# EAGLE design Schematic (EAGLE 7.2.0)
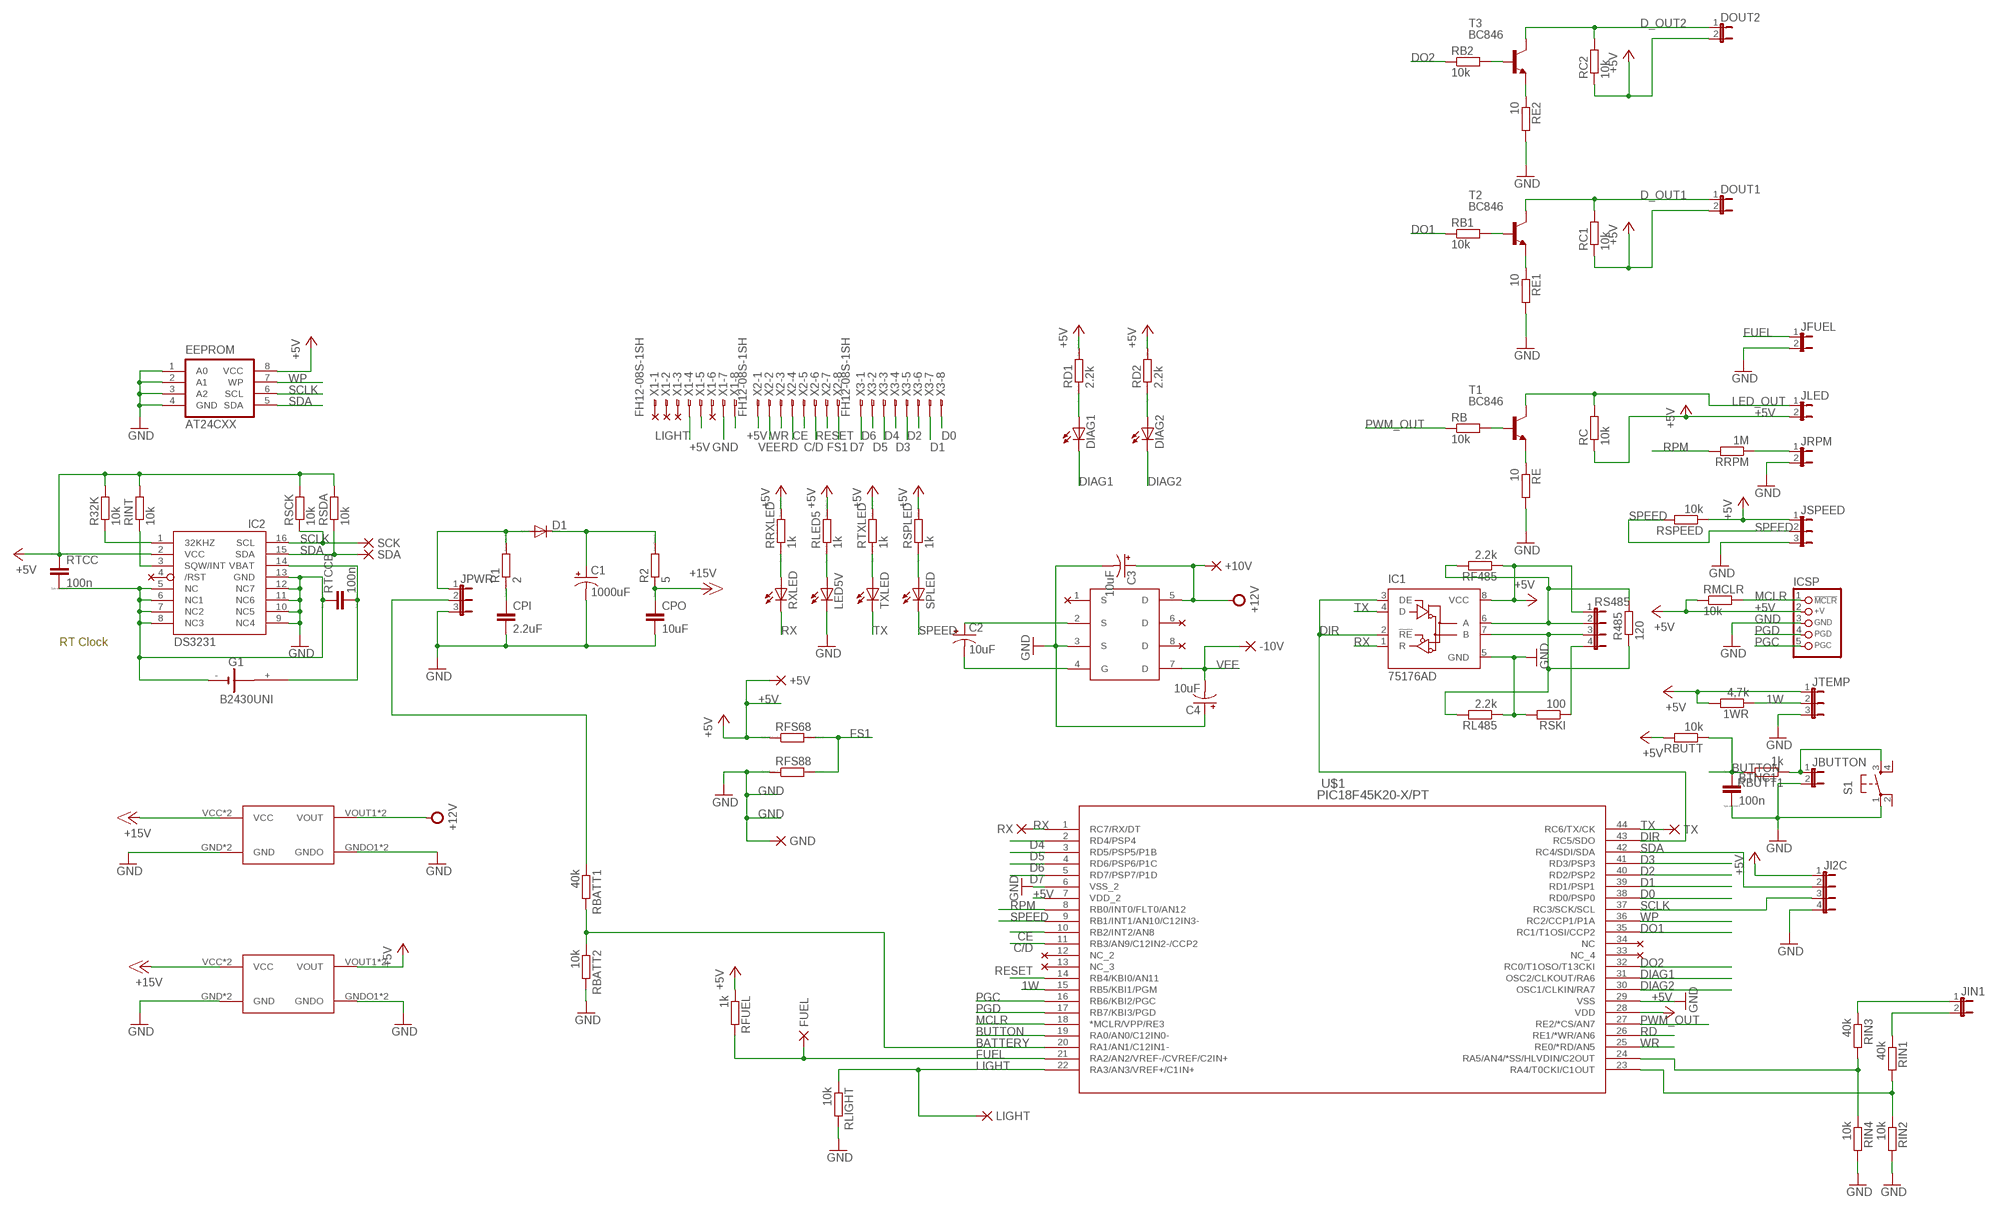
[diagram p0: schematic, sheet 1]

## Parts
1WR  4,7k  R-EU_R0603  [R0603]
+5V  PAD-SMD20R  [SMD20R]
+10V  PAD-SMD20R  [SMD20R]
-10V  PAD-SMD20R  [SMD20R]
BTNC1  100n  CC1206  [C1206]
C1  1000uF  CAP_POLPTH4  [CPOL-RADIAL-1000UF-25V]
C2  10uF  10UF-16V-10%(TANT)  [EIA3216]
C3  10uF  10UF-16V-10%(TANT)  [EIA3216]
C4  10uF  10UF-16V-10%(TANT)  [EIA3216]
CPI  2.2uF  C-EUC1206  [C1206]
CPO  10uF  C-EUC1206  [C1206]
D1  DIODE-SOD106-R  [SOD106-R]
DIAG1  LEDCHIPLED_0603  [CHIPLED_0603]
DIAG2  LEDCHIPLED_0603  [CHIPLED_0603]
DOUT1  JP1E  [JP1]
DOUT2  JP1E  [JP1]
EEPROM  AT24CXX  [SO08-8S1]
FUEL  PAD-SMD20R  [SMD20R]
G1  B2430UNI  [B2430UNI]
GND  PAD-SMD20R  [SMD20R]
IC1  75176AD  [D_R-PDSO-G8]
IC2  DS3231/SO  [SO16W]
ICSP  CON_HEADER_PRG_PIC_ICSPB  [HEADER_PRG_1X05_ICSP_B]
JBUTTON  JP1E  [JP1]
JFUEL  JP1E  [JP1]
JI2C  JP4E  [JP4]
JIN1  JP1E  [JP1]
JLED  JP1E  [JP1]
JPWR  JP2E  [JP2]
JRPM  JP1E  [JP1]
JSPEED  JP2E  [JP2]
JTEMP  JP2E  [JP2]
LED5V  LEDCHIPLED_0603  [CHIPLED_0603]
LIGHT  PAD-SMD20R  [SMD20R]
PW5  DCDC_EBAY  [DCDC_EBAY]
PW12  DCDC_EBAY  [DCDC_EBAY]
R1  2  RR1206  [R1206]
R2  5  RR1206  [R1206]
R32K  10k  R-EU_R0603  [R0603]
R485  120  R-EU_R0603  [R0603]
RB  10k  R-EU_R0603  [R0603]
RB1  10k  R-EU_R0603  [R0603]
RB2  10k  R-EU_R0603  [R0603]
RBATT1  40k  R-EU_R0603  [R0603]
RBATT2  10k  R-EU_R0603  [R0603]
RBUTT  10k  R-EU_R0603  [R0603]
RBUTT1  1k  R-EU_R0603  [R0603]
RC  10k  R-EU_R0603  [R0603]
RC1  10k  R-EU_R0603  [R0603]
RC2  10k  R-EU_R0603  [R0603]
RD1  2.2k  RR0603  [R0603]
RD2  2.2k  RR0603  [R0603]
RE  10  R-EU_R0603  [R0603]
RE1  10  R-EU_R0603  [R0603]
RE2  10  R-EU_R0603  [R0603]
RF485  2.2k  R-EU_R0603  [R0603]
RFS68  RR0603  [R0603]
RFS88  RR0603  [R0603]
RFUEL  1k  R-EU_R0603  [R0603]
RIN1  40k  R-EU_R0603  [R0603]
RIN2  10k  R-EU_R0603  [R0603]
RIN3  40k  R-EU_R0603  [R0603]
RIN4  10k  R-EU_R0603  [R0603]
RINT  10k  R-EU_R0603  [R0603]
RL485  2.2k  R-EU_R0603  [R0603]
RLED5  1k  RR0603  [R0603]
RLIGHT  10k  R-EU_R0603  [R0603]
RMCLR  10k  R-EU_R0603  [R0603]
RRPM  1M  R-EU_R0603  [R0603]
RRXLED  1k  RR0603  [R0603]
RS485  JP4E  [JP4]
RSCK  10k  R-EU_R0603  [R0603]
RSDA  10k  R-EU_R0603  [R0603]
RSKI  100  R-EU_R0603  [R0603]
RSPEED  10k  R-EU_R0603  [R0603]
RSPLED  1k  RR0603  [R0603]
RTCC  100n  CC1206  [C1206]
RTCCB  100n  CC1206  [C1206]
RTXLED  1k  RR0603  [R0603]
RX  PAD-SMD20R  [SMD20R]
RXLED  LEDCHIPLED_0603  [CHIPLED_0603]
S1  TAC_SWITCHPTH  [TACTILE-PTH]
SCK  PAD-SMD20R  [SMD20R]
SDA  PAD-SMD20R  [SMD20R]
SPLED  LEDCHIPLED_0603  [CHIPLED_0603]
T1  BC846  [SOT23]
T2  BC846  [SOT23]
T3  BC846  [SOT23]
TX  PAD-SMD20R  [SMD20R]
TXLED  LEDCHIPLED_0603  [CHIPLED_0603]
U$1  PIC18F45K20-X/PT  [TQFP44_MC]
U$2  NDS8434  [SO08]
U$3  NC  [NC]
U$4  NC  [NC]
U$5  NC  [NC]
U$6  NC  [NC]
U$7  NC  [NC]
U$8  NC  [NC]
U$9  NC  [NC]
U$10  NC  [NC]
U$11  NC  [NC]
U$12  NC  [NC]
U$13  NC  [NC]
U$14  NC  [NC]
U$15  NC  [NC]
U$16  NC  [NC]
U$17  NC  [NC]
X1  FH12-08S-1SH  [FH12-08S-1SH]
X2  FH12-08S-1SH  [FH12-08S-1SH]
X3  FH12-08S-1SH  [FH12-08S-1SH]

## Nets
1W: 1WR.1 JTEMP.2 U$1.15(RB5/KBI1/PGM)
+5V: 1WR.2 +5V.PAD(P) DOUT1.2 DOUT2.2 EEPROM.8(VCC) IC1.8(VCC) IC2.2(VCC) ICSP.2(+V) JI2C.1 JLED.2 JSPEED.1 JTEMP.1 PW5.VOUT1(VOUT) PW5.VOUT2(VOUT) R32K.2 RBUTT.2 RC1.1 RC2.1 RC.1 RD1.2 RD2.2 RF485.1 RFS68.1 RFUEL.1 RINT.2 RLED5.2 RMCLR.1 RRXLED.2 RS485.1 RSCK.2 RSDA.2 RSPEED.1 RSPLED.2 RTCC.1 RTXLED.2 U$1.7(VDD_2) U$1.28(VDD) X1.5 X2.1
+12V: +10V.PAD(P) C3.A(+) PW12.VOUT1(VOUT) PW12.VOUT2(VOUT) U$2.5(D)
+15V: CPO.1 PW5.VCC PW5.VCCIN(VCC) PW12.VCC PW12.VCCIN(VCC) R2.1
BATTERY: RBATT1.2 RBATT2.1 U$1.20(RA1/AN1/C12IN1-)
BATTERY1: RIN1.2 RIN2.1 U$1.23(RA4/T0CKI/C1OUT)
BATTERY2: RIN3.2 RIN4.1 U$1.24(RA5/AN4/*SS/HLVDIN/C2OUT)
BUTTON: BTNC1.1 RBUTT1.2 RBUTT.1 U$1.19(RA0/AN0/C12IN0-)
C/D: U$1.11(RB3/AN9/C12IN2-/CCP2) X2.6
CE: U$1.10(RB2/INT2/AN8) X2.5
D0: U$1.38(RD0/PSP0) X3.8
D1: U$1.39(RD1/PSP1) X3.7
D2: U$1.40(RD2/PSP2) X3.6
D3: U$1.41(RD3/PSP3) X3.5
D4: U$1.2(RD4/PSP4) X3.4
D5: U$1.3(RD5/PSP5/P1B) X3.3
D6: U$1.4(RD6/PSP6/P1C) X3.2
D7: U$1.5(RD7/PSP7/P1D) X3.1
D_OUT1: DOUT1.1 RC1.2 T2.3(C)
D_OUT2: DOUT2.1 RC2.2 T3.3(C)
DIAG1: DIAG1.C U$1.31(OSC2/CLKOUT/RA6)
DIAG2: DIAG2.C U$1.30(OSC1/CLKIN/RA7)
DIR: IC1.2(!RE) IC1.3(DE) U$1.43(RC5/SDO)
DO1: RB1.1 U$1.35(RC1/T1OSI/CCP2)
DO2: RB2.1 U$1.32(RC0/T1OSO/T13CKI)
FS1: RFS68.2 RFS88.2 X2.8
FUEL: FUEL.PAD(P) JFUEL.1 RFUEL.2 U$1.21(RA2/AN2/VREF-/CVREF/C2IN+)
GND: BTNC1.2 C1.2(-) C3.C(-) C4.A(+) CPI.2 CPO.2 EEPROM.1(A0) EEPROM.2(A1) EEPROM.3(A2) EEPROM.4(GND) G1.- GND.PAD(P) IC1.5(GND) IC2.5(NC) IC2.6(NC1) IC2.7(NC2) IC2.8(NC3) IC2.9(NC4) IC2.10(NC5) IC2.11(NC6) IC2.12(NC7) IC2.13(GND) ICSP.3(GND) JBUTTON.2 JFUEL.2 JI2C.4 JPWR.3 JRPM.2 JSPEED.3 JTEMP.3 LED5V.C PW5.GND PW5.GND2(GND) PW5.GNDO1(GNDO) PW5.GNDO2(GNDO) PW12.GND PW12.GND2(GND) PW12.GNDO1(GNDO) PW12.GNDO2(GNDO) RBATT2.2 RE1.2 RE2.2 RE.2 RFS88.1 RIN2.2 RIN4.2 RL485.1 RLIGHT.2 RSKI.2 RTCC.2 RTCCB.1 S1.1 U$1.6(VSS_2) U$1.29(VSS) U$2.3(S) X1.7 X1.8
LED_OUT: JLED.1 RC.2 T1.3(C)
LIGHT: LIGHT.PAD(P) RLIGHT.1 U$1.22(RA3/AN3/VREF+/C1IN+) X1.4
MCLR: ICSP.1(/MCLR) RMCLR.2 U$1.18(*MCLR/VPP/RE3)
N$1: LED5V.A RLED5.1
N$2: RRXLED.1 RXLED.A
N$3: RTXLED.1 TXLED.A
N$4: JBUTTON.1 RBUTT1.1 S1.3
N$5: RE.1 T1.2(E)
N$6: JRPM.1 RRPM.1
N$7: RB.2 T1.1(B)
N$8: JPWR.2 RBATT1.1
N$9: RE1.1 T2.2(E)
N$10: RB1.2 T2.1(B)
N$11: RE2.1 T3.2(E)
N$12: RB2.2 T3.1(B)
N$13: DIAG1.A RD1.1
N$14: C1.1(+) D1.C R2.2
N$15: CPI.1 R1.1
N$16: RSPLED.1 SPLED.A
N$17: C2.A(+) U$2.2(S)
N$18: C2.C(-) U$2.4(G)
N$19: IC1.6(A) R485.2 RF485.2 RS485.2
N$20: IC1.7(B) R485.1 RL485.2 RS485.3
N$21: JIN1.2 RIN1.1
N$22: IC2.1(32KHZ) R32K.1
N$23: IC2.3(SQW/INT) RINT.1
N$24: G1.+ IC2.14(VBAT) RTCCB.2
N$25: JIN1.1 RIN3.1
N$26: D1.A JPWR.1 R1.2
N$27: DIAG2.A RD2.1
N$29: RS485.4 RSKI.1
PGC: ICSP.5(PGC) U$1.16(RB6/KBI2/PGC)
PGD: ICSP.4(PGD) U$1.17(RB7/KBI3/PGD)
PWM_OUT: RB.1 U$1.27(RE2/*CS/AN7)
RD: U$1.26(RE1/*WR/AN6) X2.4
RESET: U$1.14(RB4/KBI0/AN11) X2.7
RPM: RRPM.2 U$1.8(RB0/INT0/FLT0/AN12)
RX: IC1.1(R) RX.PAD(P) RXLED.C U$1.1(RC7/RX/DT)
SCLK: EEPROM.6(SCL) IC2.16(SCL) JI2C.3 RSCK.1 SCK.PAD(P) U$1.37(RC3/SCK/SCL)
SDA: EEPROM.5(SDA) IC2.15(SDA) JI2C.2 RSDA.1 SDA.PAD(P) U$1.42(RC4/SDI/SDA)
SPEED: JSPEED.2 RSPEED.2 SPLED.C U$1.9(RB1/INT1/AN10/C12IN3-)
TX: IC1.4(D) TX.PAD(P) TXLED.C U$1.44(RC6/TX/CK)
VEE: -10V.PAD(P) C4.C(-) U$2.7(D) X2.2
WP: EEPROM.7(WP) U$1.36(RC2/CCP1/P1A)
WR: U$1.25(RE0/*RD/AN5) X2.3
Unconnected: G1.+@1(+) G1.+@2(+) G1.+@3(+) G1.+@4(+) G1.-@1(-) IC2.4(/RST) S1.2 S1.4 U$1.12(NC_2) U$1.13(NC_3) U$1.33(NC_4) U$1.34(NC) U$2.1(S) U$2.6(D) U$2.8(D) X1.1 X1.2 X1.3 X1.6

## Notes on the sheet
- RT Clock

## Library data of the parts
1WR R485 RB RB1 RB2 RBATT1 RBATT2 RBUTT RBUTT1 RC RC1 RC2 RE RE1 RE2 RF485 RFUEL RIN1-RIN4 RL485 RLIGHT RMCLR RRPM RSKI RSPEED = resistor_3rdPin_v20:R-EU_: RESISTOR, European symbol
+5V +10V -10V FUEL GND LIGHT RX SCK SDA TX = dpads:PAD: WIRE PAD Standard US Drill Sizes and SMD pads
BTNC1 RTCC RTCCB = eagle-ltspice:C: CAPACITOR, European symbol; SPICEMODEL: NONE; SPICEPREFIX: C
C1 = SparkFun-Capacitors:CAP_POL: Capacitor Polarized These are standard SMD and PTH capacitors. Normally 10uF, 47uF, and 100uF in electrolytic and tantalum varieties. Always verify the external diameter of the through hole cap, it varies with capacity, voltage, and manufacturer. The EIA devices should be standard.
C2-C4 = SparkFun-Capacitors:10UF-16V-10%(TANT): CAP-00811 1206/EIA-3216 Tantalum capacitor; PROD_ID: CAP-00811
CPI CPO = resistor:C-EU: CAPACITOR, European symbol
D1 = diode:DIODE-: DIODE
DIAG1 DIAG2 LED5V RXLED SPLED TXLED = adafruit:LED: LED OSRAM: - CHIPLED LG R971, LG N971, LY N971, LG Q971, LY Q971, LO R971, LY R971 LH N974, LH R974 LS Q976, LO Q976, LY Q976 LO Q996 - Hyper CHIPLED LW Q18S LB Q993, LB Q99A, LB R99A - SideLED LS A670, LO A670, LY A670, LG A670, LP A670 LB A673, LV A673, LT A673, LW A673 LH A674 LY A675 LS A676, LA A676, LO A676, LY A676, LW A676 LS A679, LY A679, LG A679 - Hyper Micro SIDELED® LS Y876, LA Y876, LO Y876, LY Y876 LT Y87S - SmartLED LW L88C, LW L88S LB L89C, LB L89S, LG L890 LS L89K, LO L89K, LY L89K LS L896, LA L896, LO L896, LY L896 - TOPLED LS T670, LO T670, LY T670, LG T670, LP T670 LSG T670, LSP T670, LSY T670, LOP T670, LYG T670 LG T671, LOG T671, LSG T671 LB T673, LV T673, LT T673, LW T673 LH T674 LS T676, LA T676, LO T676, LY T676, LB T676, LH T676, LSB T676, LW T676 LB T67C, LV T67C, LT T67C, LS T67K, LO T67K, LY T67K, LW E67C LS E67B, LA E67B, LO E67B, LY E67B, LB E67C, LV E67C, LT E67C LW T67C LS T679, LY T679, LG T679 LS T770, LO T770, LY T770, LG T770, LP T770 LB T773, LV T773, LT T773, LW T773 LH T774 LS E675, LA E675, LY E675, LS T675 LS T776, LA T776, LO T776, LY T776, LB T776 LHGB T686 LT T68C, LB T68C - Hyper Mini TOPLED® LB M676 - Mini TOPLED Santana® LG M470 LS M47K, LO M47K, LY M47K Source: http://www.osram.convergy.de/
DOUT1 DOUT2 JBUTTON JFUEL JIN1 JLED JRPM = jumper:JP1E: JUMPER
EEPROM = memory-atmel:AT24CXX: EEPROM SPI bus serial
G1 = battery:B2430UNI: LI BATTERY
IC1 = 751xx:75176A: DIFFERENTIAL BUS TRANSCEIVER Source: http://focus.ti.com/lit/ds/symlink/sn75176a.pdf
IC2 = adafruit:DS3231
ICSP = dp_devices:CON_HEADER_PRG_PIC_ICSP: 5-pin PIC In Circuit Serial Programming header
JI2C RS485 = jumper:JP4E: JUMPER
JPWR JSPEED JTEMP = jumper:JP2E: JUMPER
PW5 PW12 = DCDC_ebay:DCDC_EBAY
R1 R2 RD1 RD2 RFS68 RFS88 RLED5 RRXLED RSPLED RTXLED = eagle-ltspice:R: RESISTOR, European symbol; SPICEMODEL: NONE; SPICEPREFIX: R
R32K RINT RSCK RSDA = resistor:R-EU_: RESISTOR, European symbol
S1 = SparkFun:TAC_SWITCH: Momentary Switch Button commonly used for reset or general input. Spark Fun Electronics SKU : COM-00097
T1-T3 = transistor:BC846: NPN TRANSISTOR
U$1 = PIC18F45K20_SMD:PIC18F45K20-X/PT
U$2 = SparkFun-DiscreteSemi:NDS8434: 8-SOIC NMOSFET
U$3-U$17 = divers:NC: No connect symbol
X1-X3 = con-hirose:FH12-08S-1S: 1mm Pitch Connectors For FPC/FFC Source: Data sheet <http://www.hirose.co.jp/cataloge_hp/e58605370.pdf>; OC_FARNELL: unknown; OC_NEWARK: unknown

## Board
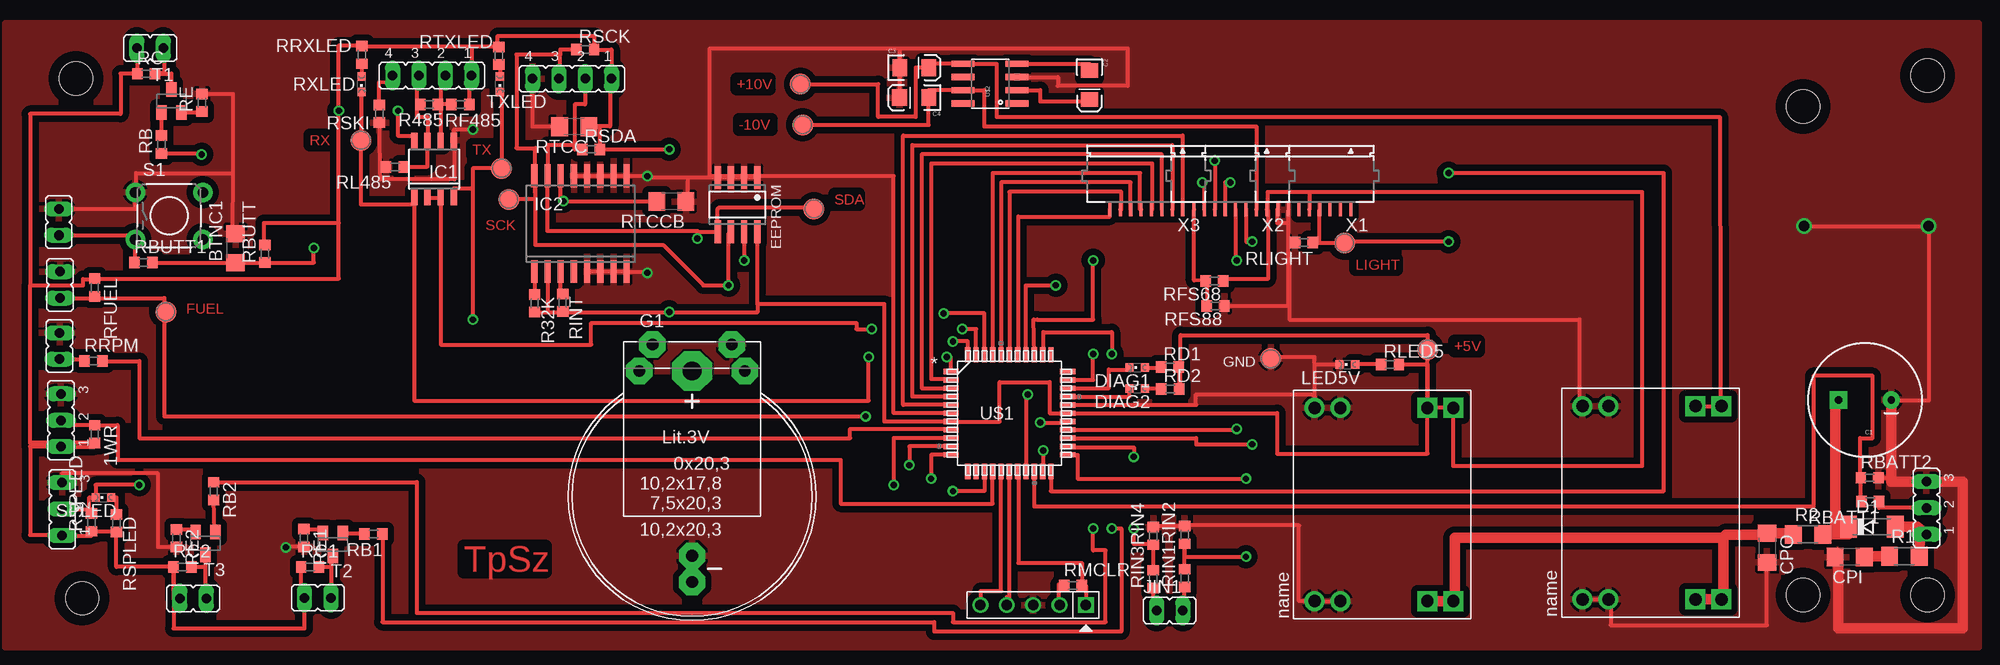
[diagram p1: board, top side]
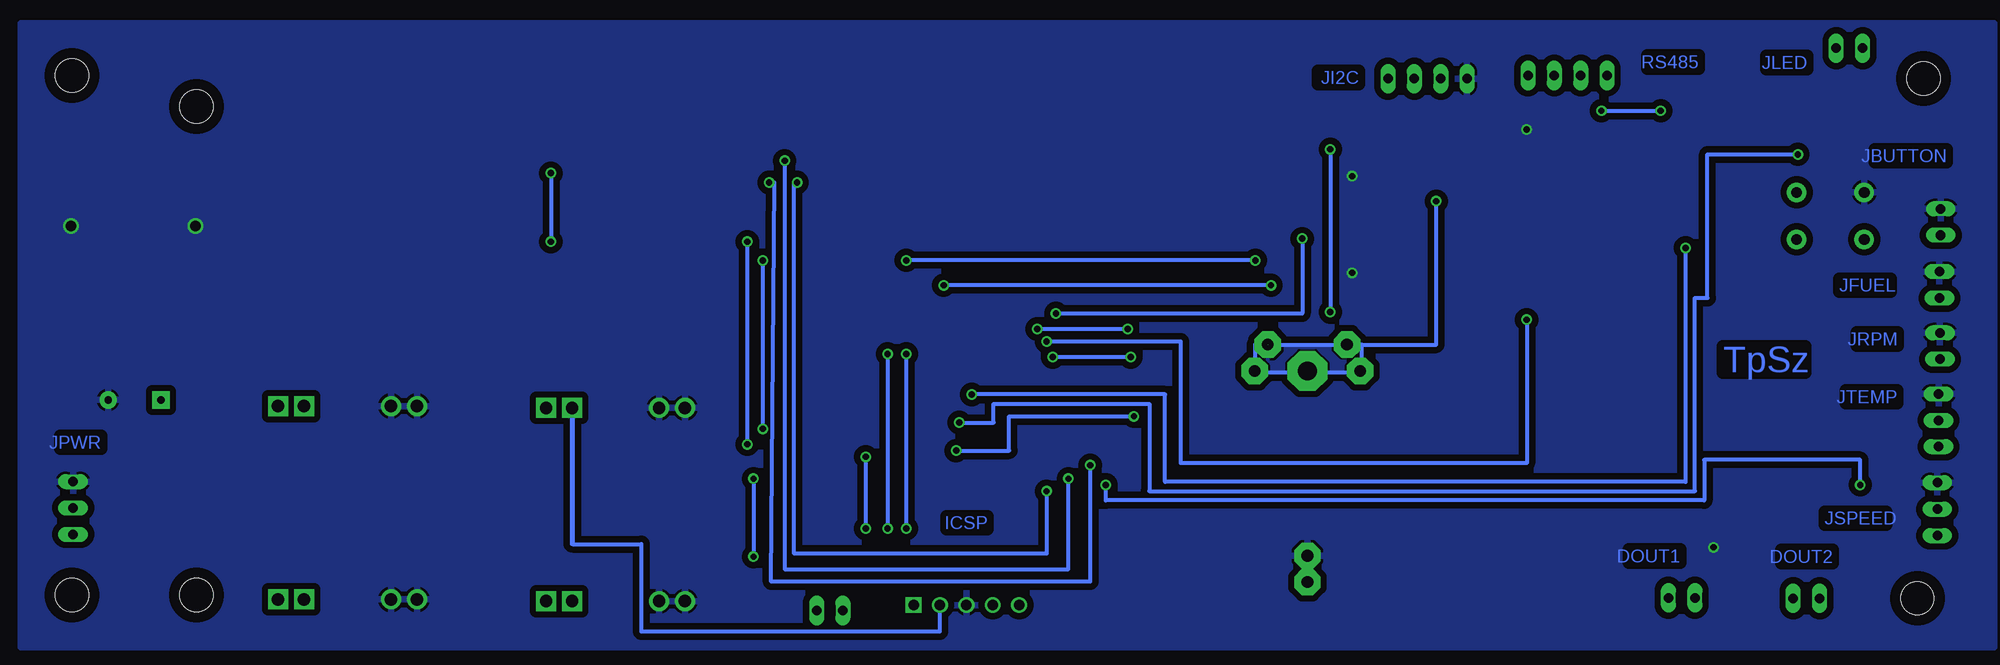
[diagram p2: board, bottom side, seen from below]

No outline drawn. Coordinates in mm, seen from the top.
Copper layers (1*16): Top 0.035mm / dielectric 1.5mm / Bottom 0.035mm
Design rules "default": minimum track width 10mil, minimum drill 24mil, track to track 8mil, track to pad 8mil, pad to pad 8mil, via to via 8mil, smd to smd 8mil, copper to edge 40mil, drill to drill 8mil, minimum pad ring 10mil, minimum via ring 8mil, stop-mask expansion 4mil, vias tented up to drill 0mil, thermal gap 10mil
Holes 3.2 mm at 7.4,4.7 6.8,54.7 185,55 185,5 173,52 173,5

### Footprints (pad centres in the part's own frame; a part is rotated, then mirrored left to right if it is on the bottom)
R0603 = smd 1 x 1.1: 1 -0.85,0; 2 0.85,0
SMD20R = smd 2 x 2: PAD 0,0
C1206 = smd 1.6 x 1.8: 1 -1.4,0; 2 1.4,0
CPOL-RADIAL-1000UF-25V = drill 0.7 pad 1.651 square: 1 2.54,0 | drill 0.7 pad 1.651: 2 -2.54,0
EIA3216 = smd 1.4 x 1.6: A 1.4,0; C -1.4,0
SOD106-R = smd 1.6 x 2.1: A 2.25,0; C -2.25,0
CHIPLED_0603 = smd 0.8 x 0.8: A 0,-0.75; C 0,0.75
JP1 = drill 0.914 long: 1 0,-1.27; 2 0,1.27
SO08-8S1 = smd 0.6 x 2.2: 1 -1.905,-2.6; 2 -0.635,-2.6; 3 0.635,-2.6; 4 1.905,-2.6; 5 1.905,2.6; 6 0.635,2.6; 7 -0.635,2.6; 8 -1.905,2.6
B2430UNI = drill 1.118 pad 2.54 octagon: + 3.81,14.605; +@1 -3.81,14.605; +@2 -5.08,12.065; +@3 5.08,12.065; - 0,-5.715; -@1 0,-8.255 | drill 1.803 pad 3.81 octagon: +@4 0,12.065
D_R-PDSO-G8 = smd 0.6 x 1.5: 1 -1.905,-2.75; 2 -0.635,-2.75; 3 0.635,-2.75; 4 1.905,-2.75; 5 1.905,2.75; 6 0.635,2.75; 7 -0.635,2.75; 8 -1.905,2.75
SO16W = smd 0.6 x 2.2: 1 -4.445,-4.6; 2 -3.175,-4.6; 3 -1.905,-4.6; 4 -0.635,-4.6; 5 0.635,-4.6; 6 1.905,-4.6; 7 3.175,-4.6; 8 4.445,-4.6; 9 4.445,4.6; 10 3.175,4.6; 11 1.905,4.6; 12 0.635,4.6; 13 -0.635,4.6; 14 -1.905,4.6; 15 -3.175,4.6; 16 -4.445,4.6
HEADER_PRG_1X05_ICSP_B = drill 1.016 square: 1 -5.08,0 | drill 1.016: 2 -2.54,0; 3 0,0; 4 2.54,0; 5 5.08,0
JP4 = drill 0.914 long: 1 -3.81,0; 2 -1.27,0; 3 1.27,0; 4 3.81,0
JP2 = drill 0.914 long: 1 -2.54,0; 2 0,0; 3 2.54,0
DCDC_EBAY = drill 1.2 pad 1.93: GND 1.7,14.57; GND2 1.7,12.07; GNDO1 20.3,14.57; GNDO2 20.3,12.07 | drill 1.2 pad 1.93 square: VCC 1.7,3.7; VCCIN 1.7,1.2; VOUT1 20.3,3.7; VOUT2 20.3,1.2
R1206 = smd 1.6 x 1.803: 1 -1.422,0; 2 1.422,0
TACTILE-PTH = drill 1.016 pad 1.88: 1 -3.251,2.261; 2 3.251,2.261; 3 -3.251,-2.261; 4 3.251,-2.261
SOT23 = smd 1 x 1.4: 1 -0.95,-1.1; 2 0.95,-1.1; 3 0,1.1
TQFP44_MC = smd 1.473 x 0.508: 1 -5.619,4; 2 -5.619,3.2; 3 -5.619,2.4; 4 -5.619,1.6; 5 -5.619,0.8; 6 -5.619,0; 7 -5.619,-0.8; 8 -5.619,-1.6; 9 -5.619,-2.4; 10 -5.619,-3.2; 11 -5.619,-4; 23 5.619,-4; 24 5.619,-3.2; 25 5.619,-2.4; 26 5.619,-1.6; 27 5.619,-0.8; 28 5.619,0; 29 5.619,0.8; 30 5.619,1.6; 31 5.619,2.4; 32 5.619,3.2; 33 5.619,4 | smd 0.508 x 1.473: 12 -4,-5.619; 13 -3.2,-5.619; 14 -2.4,-5.619; 15 -1.6,-5.619; 16 -0.8,-5.619; 17 0,-5.619; 18 0.8,-5.619; 19 1.6,-5.619; 20 2.4,-5.619; 21 3.2,-5.619; 22 4,-5.619; 34 4,5.619; 35 3.2,5.619; 36 2.4,5.619; 37 1.6,5.619; 38 0.8,5.619; 39 0,5.619; 40 -0.8,5.619; 41 -1.6,5.619; 42 -2.4,5.619; 43 -3.2,5.619; 44 -4,5.619
SO08 = smd 0.61 x 2.21: 1 -1.905,-2.616; 2 -0.635,-2.616; 3 0.635,-2.616; 4 1.905,-2.616; 5 1.905,2.616; 6 0.635,2.616; 7 -0.635,2.616; 8 -1.905,2.616
FH12-08S-1SH = smd 0.3 x 1.3: 1 -3.5,3.25; 2 -2.5,3.25; 3 -1.5,3.25; 4 -0.5,3.25; 5 0.5,3.25; 6 1.5,3.25; 7 2.5,3.25; 8 3.5,3.25

### Placement (x,y rotation side)
1WR  8.61,20.49 270 top
+5V  136.88,28.65 0 top
+10V  76.53,54.15 0 top
-10V  76.73,50.25 0 top
BTNC1  22.16,38.37 90 top
C1  178.97,23.77 180 top
C2  104.34,54.06 270 top
C3  87.49,55.74 0 top
C4  87.46,52.86 180 top
CPI  177.5,8.66 180 top
CPO  169.54,9.55 270 top
D1  179.63,11.57 0 top
DIAG1  108.93,26.89 90 top
DIAG2  108.93,24.88 90 top
DOUT1  30.08,4.74 90 top
DOUT2  18.08,4.69 90 top
DRILEGEND  [DRILEGEND]  -0.3,-4.11 0 top
EEPROM  70.47,42.57 180 top
FUEL  15.45,32.25 0 top
G1  66.1,14.5 0 top
GND  121.78,27.75 0 top
IC1  41.27,45.99 0 top
IC2  55.36,40.73 0 top
ICSP  98.92,4.04 180 top
JBUTTON  5.15,40.89 0 top
JFUEL  5.27,34.84 0 top
JI2C  54.54,54.68 180 top
JIN1  112.06,3.53 270 top
JLED  13.94,57.62 90 top
JPWR  184.88,13.38 90 top
JRPM  5.22,28.96 0 top
JSPEED  5.48,13.27 90 top
JTEMP  5.36,21.82 90 top
LED5V  129.15,27.18 90 top
LIGHT  128.88,38.87 0 top
PW5  140.56,2.71 90 top
PW12  166.36,2.88 90 top
R1  182.77,8.74 0 top
R2  173.49,10.84 0 top
R32K  50.94,33.08 270 top
R485  40.8,52.2 0 top
RB  15.04,48.35 90 top
RB1  35.43,10.89 180 top
RB2  20.06,15.01 270 top
RBATT1  179.49,14.01 180 top
RBATT2  179.42,16.29 0 top
RBUTT  24.99,37.83 90 top
RBUTT1  13.3,36.99 0 top
RC  13.57,55.16 0 top
RC1  29.33,7.71 0 top
RC2  17.05,7.71 0 top
RD1  112.09,26.94 0 top
RD2  112.11,24.84 0 top
RE  18.94,52.36 90 top
RE1  28.76,10.49 270 top
RE2  16.46,10.47 270 top
RF485  43.8,52.2 180 top
RFS68  116.36,35.23 180 top
RFS88  116.48,32.83 180 top
RFUEL  8.61,34.59 270 top
RIN1  113.49,6.64 90 top
RIN2  113.49,10.79 90 top
RIN3  110.49,6.54 90 top
RIN4  110.49,10.69 90 top
RINT  53.64,33.13 270 top
RL485  37.5,46.2 0 top
RLED5  133.27,27.19 0 top
RLIGHT  124.97,38.91 180 top
RMCLR  102.75,5.91 0 top
RRPM  8.49,27.51 0 top
RRXLED  34.31,56.97 90 top
RS485  41.07,54.98 180 top
RSCK  55.82,57.49 0 top
RSDA  56.37,47.89 0 top
RSKI  36,51.3 270 top
RSPEED  8.31,11.99 90 top
RSPLED  10.69,11.92 270 top
RTCC  54.75,50.06 180 top
RTCCB  64.11,42.86 180 top
RTXLED  47.51,56.89 90 top
RX  34.23,48.75 0 top
RXLED  34.29,54.15 180 top
S1  15.76,41.49 0 top
SCK  48.45,43.08 90 top
SDA  77.83,42.15 0 top
SPLED  9.45,14.4 90 top
T1  15.99,52.53 0 top
T2  31.53,9.87 180 top
T3  19.28,9.98 180 top
TX  47.75,46.05 0 top
TXLED  47.61,54.15 180 top
U$1  96.63,22.5 0 top
U$2  94.77,54.21 90 top
U$3  98.01,52.35 0 top
U$4  129.37,41.55 0 top
U$5  124.43,41.85 0 top
U$6  19.29,43.65 0 top
U$7  18.85,39.45 0 top
U$8  124.31,24.75 0 top
U$9  122.37,4.65 0 top
U$10  91.33,52.35 0 top
U$11  100.63,28.19 0 top
U$12  91.19,54.89 0 top
U$13  127.35,41.69 0 top
U$14  128.41,41.69 0 top
U$15  102.47,26.69 0 top
U$16  93.33,15.89 0 top
U$17  92.59,15.89 0 top
X1  125.99,45.34 180 top
X2  117.9,45.34 180 top
X3  109.81,45.34 180 top

### Tracks (layer width: path | path; a pad name or v marks a point on that pad's centre or on a via)
1W
  Top 0.406: JTEMP.2 5.36,21.34 1WR.1 10.8,21.34 10.8,18 80.4,18 80.4,13.8 95.03,13.8 U$1.15
+5V  (via drill 0.6)
  Top 0.406: PW5.VOUT1 PW5.VOUT2 139.36,17.4 157.5,17.4 157.5,43.8 125.49,43.8 | PW5.VOUT1 136.88,27.61 +5V.PAD 136.88,30 113.1,30 113.1,24.84 RD2.2 112.96,26.64 RD1.2 | RLED5.2 136.86,27.19 PW5.VOUT1 | DOUT2.2 16.2,4.69 RC2.1 | RC1.1 28.48,4.74 DOUT1.2 28.81,1.8 16.2,1.8 RC2.1 | RC2.1 10.69,7.71 RSPLED.2 10.69,11.14 RSPEED.1 8.31,10.73 JSPEED.1 5.48,10.8 2.4,10.8 2.4,19.28 JTEMP.1 8.61,19.28 1WR.2 2.4,19.64 2.4,34.8 | 2.4,34.8 7.5,34.8 7.5,35.4 8.61,35.4 RFUEL.1 32.1,35.44 32.1,40.8 | JLED.2 12.72,57.92 RC.1 11.1,55.16 11.1,51.3 2.4,51.3 2.4,34.8 | RTXLED.2 44.88,57.74 RS485.1 44.65,54.38 RF485.1 | RBUTT.2 24.9,38.68 24.9,40.8 32.1,40.8 | 32.1,40.8 v32.1,51.6 32.1,57.9 34.31,57.9 RRXLED.2 47.51,57.82 RTXLED.2 | ICSP.2 101.4,4.04 101.4,6 101.9,6 RMCLR.1 101.4,5.91 | 53.64,32.23 RINT.2 | R32K.2 52.2,32.23 | 52.2,32.23 53.64,32.23 | 53.64,32.23 v63.9,32.23 72.38,32.23 72.38,33 | 72.38,33 EEPROM.8 | IC2.2 52.2,32.23 | RTXLED.2 47.4,57.74 47.4,58.8 56.67,58.8 RSCK.2 58.35,57.49 JI2C.1 58.2,54.38 58.2,50.1 56.15,50.1 RTCC.1 57.22,50.06 RSDA.2 v63.9,47.89 | 125.49,43.8 121.5,43.8 121.5,42.09 | 125.49,43.8 X1.5 | X2.1 121.5,42.09 | 121.5,42.09 121.5,35.4 117.21,35.4 RFS68.1 | 72.38,33 84.6,33 84.6,21.7 U$1.7 95.7,21.7 95.7,25.5 100.5,25.5 100.5,22.5 U$1.28 122.4,22.5 122.4,18.6 136.86,18.6 PW5.VOUT1 | v37.8,51.6 37.8,49.2 39.3,49.2 39.3,48.74 IC1.8
  Bottom 0.406: ICSP.2 101.46,1.5 130.2,1.5 130.2,9.9 136.8,9.9 136.8,23.1 136.86,9.9 PW5.VOUT1 | v63.9,47.89 v63.9,32.23 | v37.8,51.6 v32.1,51.6
+12V
  Top 0.406: +10V.PAD 84,54.15 84,51 87.6,51 87.6,55.74 C3.A 88.89,56.12 U$2.5 95.4,56.12 95.4,51 165,51 165.06,30 165.06,23.28 PW12.VOUT2 PW12.VOUT1
+15V
  Top 1.016: R2.1 172.07,10.95 CPO.1 169.39,10.8 165.6,10.8 165.36,10.56 165.36,10.5 | PW5.VCC PW5.VCCIN 139.5,4.55 139.5,10.5 165.36,10.5 | PW12.VCC PW12.VCCIN 165.36,4.78 165.36,10.5
BATTERY
  Top 0.406: RBATT1.2 178.57,14.01 RBATT2.1 178.5,16.29 178.5,20.1 179.7,20.1 179.7,26.1 174,26.1 174,13.5 99.03,13.5 U$1.20
BATTERY1  (via drill 0.6)
  Top 0.406: RIN1.2 RIN2.1 113.49,8.7 v119.4,8.7 | v119.4,16.2 103.2,16.2 103.2,18.5 U$1.23
  Bottom 0.406: v119.4,16.2 v119.4,8.7
BATTERY2  (via drill 0.6)
  Top 0.406: RIN3.2 RIN4.1 110.49,9.9 108.6,9.9 v108.6,11.4 | U$1.24 102.25,19.2 108.6,19.2 v108.6,18.3
  Bottom 0.406: v108.6,18.3 v108.6,11.4
BUTTON  (via drill 0.6)
  Top 0.406: RBUTT1.2 22.16,36.99 BTNC1.1 22.28,36.97 RBUTT.1 29.7,36.98 v29.7,38.4 | v98.4,24.3 98.23,24 U$1.19
  Bottom 0.406: v29.7,38.4 29.7,15.9 79.8,15.9 79.8,24.3 v98.4,24.3
C/D  (via drill 0.6)
  Top 0.406: U$1.11 89.1,18.5 v89.1,16.2 | v116.4,46.8 X2.6
  Bottom 0.406: v116.4,46.8 116.4,7.5 89.1,7.5 v89.1,16.2
CE  (via drill 0.6)
  Top 0.406: U$1.10 87,19.3 v87,17.5 | v117.9,44.7 117.4,44.7 X2.5
  Bottom 0.406: v87,17.5 87,6.3 117.7,6.3 117.4,44.7 v117.9,44.7
D0
  Top 0.406: U$1.38 97.5,28.12 97.5,41.4 106.31,41.4 X3.8
D1
  Top 0.406: X3.7 107.4,42.09 107.4,43.8 96.63,43.8 U$1.39
D2
  Top 0.406: X3.6 108.3,44.7 95.83,44.7 U$1.40
D3
  Top 0.406: X3.5 109.2,42.09 109.2,45.6 95.03,45.6 U$1.41
D4
  Top 0.406: X3.4 110.4,42.09 110.4,46.5 89.1,46.5 89.1,25.8 91.01,25.8 U$1.2
D5
  Top 0.406: X3.3 111.3,47.4 88.2,47.4 88.2,24.9 U$1.3 | U$1.3
D6
  Top 0.406: U$1.4 87.3,24.1 87.3,48.3 112.31,48.3 X3.2
D7
  Top 0.406: U$1.5 86.4,23.3 86.4,49.2 113.31,49.2 X3.1
D_OUT1
  Top 0.406: RC1.2 31.35,7.71 | 31.35,7.71 DOUT1.1 | T2.3 31.35,8.77 31.35,7.71
D_OUT2
  Top 0.406: RC2.2 19.28,7.71 | 19.28,7.71 19.28,8.1 T3.3 | DOUT2.1 19.28,4.69 19.28,7.71
DIAG1
  Top 0.406: U$1.31 106.2,24.9 106.2,26.7 108.18,26.7 DIAG1.C
DIAG2
  Top 0.406: U$1.30 108.18,24.1 DIAG2.C
DIR  (via drill 0.6)
  Top 0.406: IC1.2 IC1.3 41.91,29.1 56.4,29.1 56.4,31.2 81.9,31.2 81.9,30.6 v83.4,30.6 | U$1.43 93.43,30.6 v92.1,30.6
  Bottom 0.406: v83.4,30.6 v92.1,30.6
DO1  (via drill 0.6)
  Top 0.406: RB1.1 36.3,10.89 36.3,2.4 89.4,2.4 89.4,1.5 107.4,1.5 107.4,11.4 v106.5,11.4 | U$1.35 99.9,28.12 99.9,30.3 106.5,30.3 v106.5,28.2
  Bottom 0.406: v106.5,28.2 v106.5,11.4
DO2  (via drill 0.6)
  Top 0.406: U$1.32 104.7,25.7 v104.7,28.2 | RB2.1 39.6,15.86 39.6,3.3 91.2,3.3 91.2,2.4 105.9,2.4 105.9,9.3 104.7,9.3 v104.7,11.4
  Bottom 0.406: v104.7,11.4 v104.7,28.2
FS1
  Top 0.406: X2.8 114.4,35.27 RFS68.2 115.63,35.23 RFS88.2
FUEL  (via drill 0.6)
  Top 0.406: JFUEL.1 8.61,33.57 | 8.61,33.57 RFUEL.2 | 8.61,33.57 15.27,33.57 15.3,33.6 15.3,31.95 | FUEL.PAD 15.3,31.95 | 15.3,31.95 15.3,31.5 15.3,22.2 v82.8,22.2 | U$1.21 99.9,16.88 v99.9,18.9
  Bottom 0.406: v99.9,18.9 94.8,18.9 94.8,22.2 v82.8,22.2
GND  (via drill 0.6, 1)
  Top 0.406: C4.A 86.09,52.86 C3.C 86.1,55.44 86.1,57.6 | RBATT2.2 181.51,16.29 181.51,16.5 | 21.9,45.6 12.6,45.6 12.6,43.75 S1.1 12.51,42.16 JBUTTON.2 | 21.9,45.6 21.86,39.9 BTNC1.2 | IC2.13 IC2.12 IC2.11 IC2.10 IC2.9 61.8,45.33 v61.8,45.3 61.8,45.17 65.7,45.17 | IC2.5 IC2.6 IC2.7 IC2.8 61.8,36.13 v61.8,36 | 28.76,9.6 RE1.2 27.3,9.64 v27,9.6 | RE2.2 14.7,9.62 14.7,16.71 5.48,16.71 JSPEED.3 | RE.2 21.9,53.21 21.9,45.6 | RIN4.2 110.49,11.64 RIN2.2 113.49,11.7 124.5,11.7 124.5,4.41 PW5.GND PW5.GND2 | 65.7,45.17 EEPROM.4 EEPROM.3 EEPROM.2 EEPROM.1 67.8,45.17 67.8,45.3 | 86.1,57.6 108,57.6 108,54 101.29,54 101.29,54.84 U$2.3 | RLIGHT.2 123.49,38.91 | 123.49,38.91 123.49,40.8 | 123.49,40.8 X1.7 | RFS88.1 123.49,32.83 | 123.49,32.83 123.49,38.91 | X1.8 122.4,42.09 122.4,40.8 123.49,40.8 | 67.8,45.3 67.8,57.6 86.1,57.6 | U$1.6 85.5,22.5 85.5,45.3 67.8,45.3 | RTCCB.1 65.7,42.86 65.7,45.17 | 123.49,32.83 123.6,37.63 123.6,31.5 151.5,31.5 151.5,23.18 PW12.GNDO1 | RSKI.2 36,49.2 36.05,45.89 | 36.05,45.89 36.06,45 43.2,45 43.2,48.44 IC1.5 43.2,48.74 43.2,49.8 v45,49.8 | 125.99,23.44 PW5.GNDO1 126,24.3 | LED5V.C 126.12,27.18 126,27.3 | 126,27.3 126,24.3 | U$1.29 114.6,23.3 114.6,24.3 126,24.3 | 126,27.3 126,27.9 121.78,27.9 GND.PAD | PW12.GND PW12.GND2 154.5,4.58 154.5,2.1 169.54,2.1 CPO.2 | RL485.1 36.05,46.2 36.05,45.89 | RTCC.2 50.73,50.06 JI2C.4 | v173.1,40.5 v185.1,40.5 185.1,23.7 181.51,23.7 C1.2
  Top 1.016: CPO.2 169.5,8.45 | C1.2 181.51,16.5 181.51,15.92 JPWR.3 184.28,15.9 188.4,15.9 188.4,1.8 176.4,1.8 176.4,8.66 CPI.2
  pour Bottom (isolate 0.61): 0,0 189.9,0 189.9,60 0,60
  pour Top (isolate 0.61): 0,0 189.9,0 189.9,60 0,60
LED_OUT
  Top 0.406: JLED.1 15.3,57.92 15.3,55.2 14.42,55.2 RC.2 15.99,55.16 T1.3
LIGHT  (via drill 0.6)
  Top 0.406: X1.4 126.49,38.91 RLIGHT.1 128.88,38.91 LIGHT.PAD 128.88,39 v138.9,39 | v138.9,45.6 159.6,45.6 159.6,15 100.63,15 U$1.22
  Bottom 0.406: v138.9,45.6 v138.9,39
MCLR
  Top 0.406: ICSP.1 104,5.91 RMCLR.2 103.6,8.1 97.5,8.1 97.5,16.88 U$1.18
N$1
  Top 0.406: RLED5.1 130.2,27.19 LED5V.A
N$2
  Top 0.406: RRXLED.1 34.29,56.12 RXLED.A
N$3
  Top 0.406: RTXLED.1 47.61,56.04 TXLED.A
N$4
  Top 0.406: JBUTTON.1 12.51,39.62 S1.3 12.51,36.99 RBUTT1.1
N$5
  Top 0.406: T1.2 18.94,51.43 RE.1
N$6
  Top 0.406: JRPM.1 7.64,27.69 RRPM.1
N$7
  Top 0.406: RB.2 T1.1
N$8
  Top 0.406: JPWR.2 180.34,13.38 RBATT1.1
N$9
  Top 0.406: RE1.1 30.58,11.34 T2.2
N$10
  Top 0.406: T2.1 34.29,10.97 RB1.2
N$11
  Top 0.406: RE2.1 18.33,11.32 T3.2
N$12
  Top 0.406: T3.1 20.14,11.08 RB2.2
N$13
  Top 0.406: DIAG1.A 111.24,26.89 RD1.1
N$14
  Top 1.016: R2.2 176.1,10.84 | 176.1,10.84 177.38,10.84 D1.C | C1.1 176.1,23.77 176.1,10.84
N$15
  Top 1.016: R1.1 179.2,8.74 CPI.1
N$16
  Top 0.406: SPLED.A 10.69,14.4 RSPLED.1
N$17
  Top 0.406: U$2.2 99.6,53.58 99.6,52.5 104.34,52.5 C2.A
N$18
  Top 0.406: U$2.4 104.34,56.12 C2.C
N$19
  Top 0.406: RS485.2 41.91,54.38 41.91,52.2 | 41.91,52.2 IC1.6 | 41.91,52.2 R485.2 RF485.2
N$20
  Top 0.406: RS485.3 39.6,54.38 39.6,52.2 | 39.6,52.2 39.6,51 40.63,51 IC1.7 40.63,46.34 arc-90 40.5,46.2 RL485.2 | R485.1 39.6,52.2
N$21
  Top 0.406: JIN1.2 113.49,3.23 RIN1.1
N$22
  Top 0.406: IC2.1 50.94,36.13 R32K.1
N$23
  Top 0.406: IC2.3 53.4,36.13 53.4,33.98 RINT.1
N$24  (via drill 0.6)  (1 unrouted)
  Top 0.406: IC2.14 53.4,45.33 53.4,42.9 v53.7,42.9 62.71,42.9 RTCCB.2
  Bottom 0.406: v53.7,42.9 53.7,29.4 53.7,29.11 G1.+ | 62.7,29.1 60.9,29.1 60.9,26.4 71.1,26.4 71.1,29.1 G1.+
  pour Bottom: 60.9,29.1 60.9,26.4 70.8,26.4 70.8,29.1
  pour Top: 60.9,29.1 71.1,29.1 71.1,26.4 60.9,26.4
N$25
  Top 0.406: JIN1.1 110.49,3.23 RIN3.1
N$26
  Top 1.016: R1.2 184.24,10.81 JPWR.1 183.98,11.57 D1.A
N$27
  Top 0.406: DIAG2.A 111.56,24.88 RD2.1
N$29
  Top 0.406: RS485.4 37.2,54.38 36,54.35 RSKI.1
PGC
  Top 0.406: ICSP.5 93.9,4.04 93.9,5.4 95.83,5.4 U$1.16
PGD
  Top 0.406: U$1.17 96.6,16.88 96.6,4.8 96.38,4.8 ICSP.4
PWM_OUT  (via drill 0.6)
  Top 0.406: RB.1 18.9,47.5 v18.9,47.4 | v99.6,21.6 102.25,21.6 U$1.27
  Bottom 0.406: v99.6,21.6 96.3,21.6 96.3,23.4 81.3,23.4 81.3,15 28.8,15 28.8,33.6 27.6,33.6 27.6,47.4 v18.9,47.4
RD  (via drill 0.6)
  Top 0.406: U$1.26 118.5,20.9 v118.5,21 | X2.4 118.4,37.3 v118.5,37.2
  Bottom 0.406: v118.5,21 v118.5,37.2
RESET  (via drill 0.6)
  Top 0.406: X2.7 115.4,44.7 v115.2,44.7 | U$1.14 94.23,15 v91.2,15
  Bottom 0.406: v91.2,15 91.2,9 115.5,9 115.5,44.7 v115.2,44.7
RPM
  Top 0.406: RRPM.2 12.9,27.51 12.9,20.1 81.3,20.1 81.3,21 91.01,21 U$1.8
RX  (via drill 0.6)
  Top 0.406: RXLED.C 34.23,53.4 RX.PAD 34.23,42.6 39.37,42.6 | U$1.1 91.01,27.9 v90.6,27.9 | IC1.1 39.37,42.6 | 39.37,42.6 39.37,23.7 83.1,23.7 v83.1,27.9
  Bottom 0.406: v83.1,27.9 v90.6,27.9
SCLK  (via drill 0.6)
  Top 0.406: 51,45.63 IC2.16 50.97,43.08 SCK.PAD | 51,45.63 51,48 49.2,48 49.2,57 53.4,57 | JI2C.3 53.4,54.38 53.4,57 | RSCK.1 53.4,57.49 53.4,57 | 51,45.63 51,38.7 63.3,38.7 67.2,34.8 v69.6,34.8 69.6,39.73 EEPROM.6 | U$1.37 98.23,34.8 v101.1,34.8
  Bottom 0.406: v69.6,34.8 v101.1,34.8
SDA  (via drill 0.6)
  Top 0.406: JI2C.2 55.8,54.38 55.8,52.2 54.8,52.2 54.8,48.3 | 54.8,48.3 52.19,48.3 IC2.15 52.19,40.05 66.6,40.05 66.6,39.9 | RSDA.1 54.8,47.89 54.8,48.3 | 68.56,40.05 EEPROM.5 | EEPROM.5 68.56,39.9 66.6,39.9 | 66.6,39.9 v66.6,39.3 | U$1.42 94.23,32.1 v90.3,32.1 | EEPROM.5 68.56,42.16 68.7,42.3 77.98,42.3 SDA.PAD
  Bottom 0.406: v66.6,39.3 66.6,32.1 v90.3,32.1
SPEED  (via drill 0.6)
  Top 0.406: JSPEED.2 8.31,13.27 RSPEED.2 8.1,12.84 8.1,14.4 SPLED.C 8.7,15.6 v12.9,15.6 | U$1.9 85.5,20.1 v85.5,15.6
  Bottom 0.406: v12.9,15.6 12.9,18 27.9,18 27.9,14.1 85.5,14.1 v85.5,15.6
TX  (via drill 0.6)
  Top 0.406: 45,44.1 45,46.05 TX.PAD 47.75,53.4 TXLED.C | 45,44.1 43.17,44.1 IC1.4 | U$1.44 92.63,29.4 v91.2,29.4 | 45,44.1 v45,31.5
  Bottom 0.406: v91.2,29.4 78.3,29.4 78.3,17.7 45,17.7 v45,31.5
VEE
  Top 0.406: C4.C 88.86,53.58 U$2.7 94.2,53.58 94.2,50.1 120.4,50.1 X2.2 | C4.C 88.8,52.86 | -10V.PAD 88.86,50.25 C4.C
WP  (via drill 0.6)
  Top 0.406: EEPROM.7 v71.11,37.2 v71.1,37.2 | 99,28.12 U$1.36 98.97,31.53 99.3,31.5 104.7,31.5 v104.7,37.2
  Bottom 0.406: v71.11,37.2 v104.7,37.2
WR  (via drill 0.6)
  Top 0.406: U$1.25 114.6,20.1 114.6,19.5 v120,19.5 | X2.3 119.4,39 v120,39
  Bottom 0.406: v120,39 v120,19.5

### Text on the board
Top: TpSz
Bottom: TpSz
DrillLegend: LAYER-STACK
DrillLegend_01-16: 01-16
DrillLegend_01-20: 01-20